# Altium project UI.PrjPcb
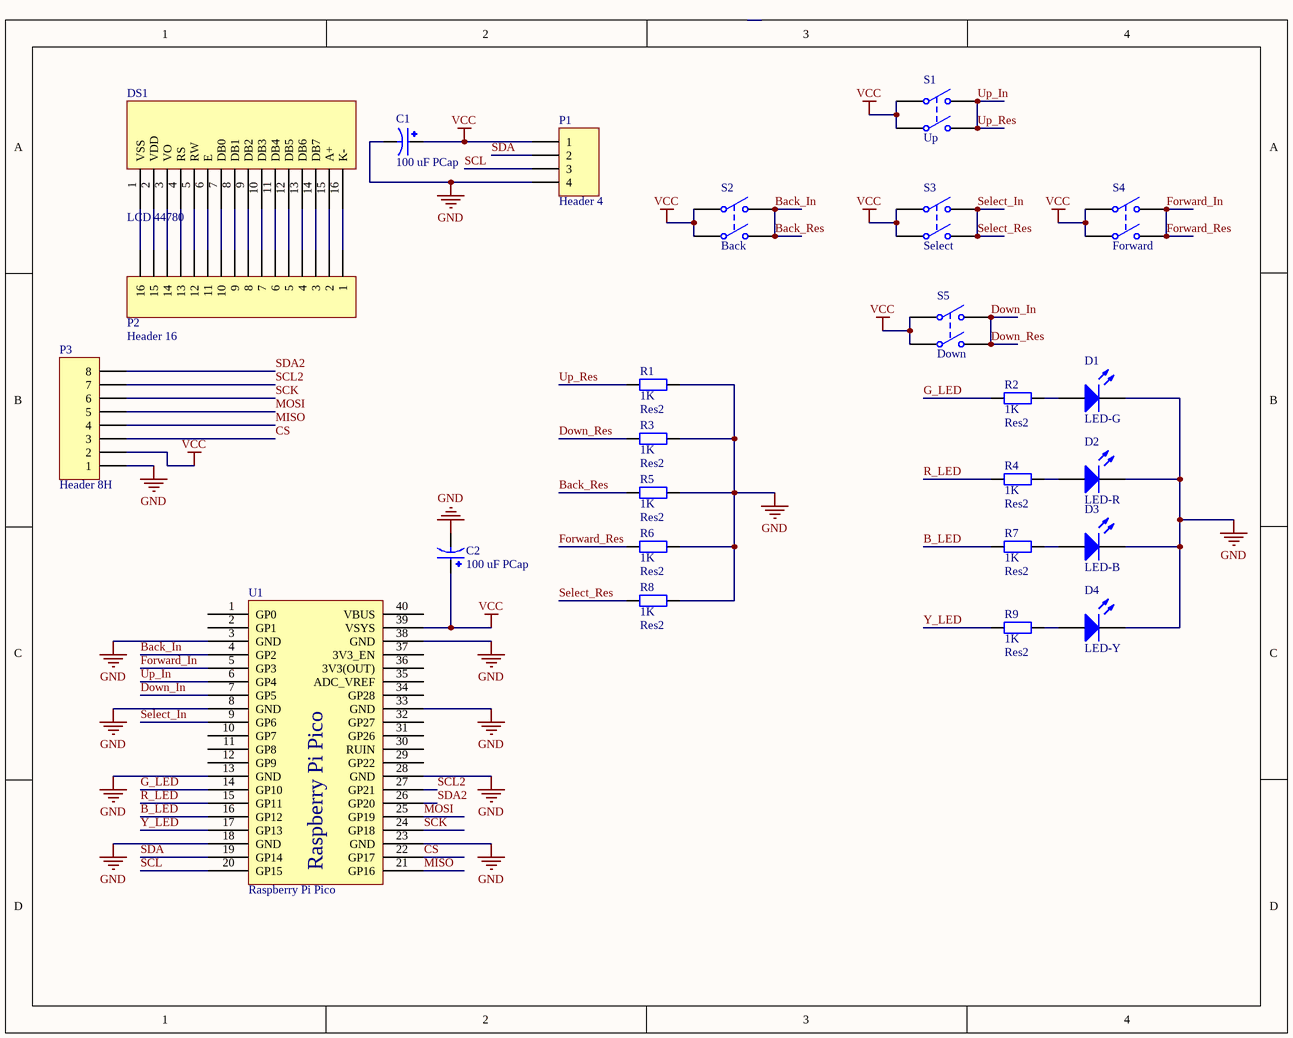
[diagram p0: UI Schematic.SchDoc]
1 sheet, 25 parts. Net scope: global (net labels, ports and power ports of the same name join across sheets).
Board file: UI PCB.PcbDoc

## Sheet UI Schematic.SchDoc
size A; SheetNumber: 1; SheetTotal: 5; SPICEModelCacheYSEURQHB: <root> / <DocumentId>YSEURQHB</DocumentId> / <CacheFrame Number="0"> / <Model Name="led1" Kind="MDL"> / <Text>*Typ RED GaAs LED: Vf=1.7V Vr=4V If=40mA trr=3uS / *LED Pinout: 1=A, 2=K / .MODEL LED1 D (IS=93.2P RS=42M N=3.73 BV=4 IBV=10U / + CJO=2.97P VJ=.75 M=.333 TT=4.32U)</Text> / </Model> / </CacheFrame> / </root>

### Parts
C1  100 uF PCap  [100uF PCap]
C2  100 uF PCap  [100uF PCap]
D1  LED-G  [LED-1]
D2  LED-R  [LED-1]
D3  LED-B  [LED-1]
D4  LED-Y  [LED-1]
DS1  LCD 44780  [OLED 16x2]
P1  Header 4  [HDR1X4]
P2  Header 16  [HDR1X16]
P3  Header 8H  [HDR1X8H]
R1  Res2  value 1K  [AXIAL-0.4]
R2  Res2  value 1K  [AXIAL-0.4]
R3  Res2  value 1K  [AXIAL-0.4]
R4  Res2  value 1K  [AXIAL-0.4]
R5  Res2  value 1K  [AXIAL-0.4]
R6  Res2  value 1K  [AXIAL-0.4]
R7  Res2  value 1K  [AXIAL-0.4]
R8  Res2  value 1K  [AXIAL-0.4]
R9  Res2  value 1K  [AXIAL-0.4]
S1  Up  [DPST-4]
S2  Back  [DPST-4]
S3  Select  [DPST-4]
S4  Forward  [DPST-4]
S5  Down  [DPST-4]
U1  Raspberry Pi Pico  [Raspberry Pi Pico]

### Nets
GND: C1.N C2.N D1.2(K) D2.2(K) D3.2(K) D4.2(K) P1.4 P3.1 R1.2 R3.2 R5.2 R6.2 R8.2 U1.3(GND) U1.8(GND) U1.13(GND) U1.18(GND) U1.23(GND) U1.28(GND) U1.33(GND) U1.38(GND)
VCC: C1.P C2.P P1.1 P3.2 S1.1(COMMON1) S1.3(COMMON2) S2.1(COMMON1) S2.3(COMMON2) S3.1(COMMON1) S3.3(COMMON2) S4.1(COMMON1) S4.3(COMMON2) S5.1(COMMON1) S5.3(COMMON2) U1.39(VSYS)
B_LED: R7.1 U1.16(GP12)
Back_In: R5.1 S2.2(NO1) S2.4(NO2) U1.4(GP2)  [also labelled Back_Res]
CS: P3.3 U1.22(GP17)
Down_In: R3.1 S5.2(NO1) S5.4(NO2) U1.7(GP5)  [also labelled Down_Res]
Forward_In: R6.1 S4.2(NO1) S4.4(NO2) U1.5(GP3)  [also labelled Forward_Res]
G_LED: R2.1 U1.14(GP10)
MISO: P3.4 U1.21(GP16)
MOSI: P3.5 U1.25(GP19)
R_LED: R4.1 U1.15(GP11)
SCK: P3.6 U1.24(GP18)
SCL: P1.3 U1.20(GP15)
SCL2: P3.7 U1.27(GP21)
SDA: P1.2 U1.19(GP14)
SDA2: P3.8 U1.26(GP20)
Select_In: R8.1 S3.2(NO1) S3.4(NO2) U1.9(GP6)  [also labelled Select_Res]
Up_In: R1.1 S1.2(NO1) S1.4(NO2) U1.6(GP4)  [also labelled Up_Res]
Y_LED: R9.1 U1.17(GP13)
NetD1_1: D1.1(A) R2.2
NetD2_1: D2.1(A) R4.2
NetD3_1: D3.1(A) R7.2
NetD4_1: D4.1(A) R9.2
NetDS1_1: DS1.1(VSS) P2.16
NetDS1_2: DS1.2(VDD) P2.15
NetDS1_3: DS1.3(VO) P2.14
NetDS1_4: DS1.4(RS) P2.13
NetDS1_5: DS1.5(RW) P2.12
NetDS1_6: DS1.6(E) P2.11
NetDS1_7: DS1.7(DB0) P2.10
NetDS1_8: DS1.8(DB1) P2.9
NetDS1_9: DS1.9(DB2) P2.8
NetDS1_10: DS1.10(DB3) P2.7
NetDS1_11: DS1.11(DB4) P2.6
NetDS1_12: DS1.12(DB5) P2.5
NetDS1_13: DS1.13(DB6) P2.4
NetDS1_14: DS1.14(DB7) P2.3
NetDS1_15: DS1.15(A+) P2.2
NetDS1_16: DS1.16(K-) P2.1

Not connected (* = marked no-connect by the designer): U1 1(GP0) 2(GP1) 10(GP7) 11(GP8) 12(GP9) 29(GP22) 30(RUIN) 31(GP26) 32(GP27) 34(GP28) 35(ADC_VREF) 36(3V3(OUT)) 37(3V3_EN) 40(VBUS)

### Library data of the parts
C1 C2 = 100 uF PCap: Capacitor; Aluminum Electrolytic; Radial Al Electrolytic Cap; 100uF 63V; MF: Panasonic Electronic; MP: EEU-FC1J101; Package: RADIAL-2 Panasonic; Price: None; Check_prices: https://www.snapeda.com/parts/EEU-FC1J101/Panasonic%20Electronic%20Components/view-part/494707/?ref=eda; Value: *; SnapEDA_Link: https://www.snapeda.com/parts/EEU-FC1J101/Panasonic%20Electronic%20Components/view-part/494707/?ref=snap; Availability: In Stock
D1-D4 = LED1: Typical RED GaAs LED; Published: 8-Jun-2000; LatestRevisionDate: 08-Jul-2005; LatestRevisionNote: Mech Layer 1 removed.; PackageReference: LED-1; Publisher: Altium Limited; PackageDescription: LED; 2 Leads
P1 = Header 4: Header, 4-Pin; LatestRevisionDate: 17-Jul-2002; LatestRevisionNote: Re-released for DXP Platform.; Publisher: Altium Limited
P2 = Header 16: Header, 16-Pin; LatestRevisionDate: 17-Jul-2002; LatestRevisionNote: Re-released for DXP Platform.; Publisher: Altium Limited
P3 = Header 8H: Header, 8-Pin, Right Angle; LatestRevisionDate: 17-Jul-2002; LatestRevisionNote: Re-released for DXP Platform.; Publisher: Altium Limited
R1-R9 = Res2: Resistor; Published: 8-Jun-2000; LatestRevisionDate: 17-Jul-2002; LatestRevisionNote: Re-released for DXP Platform.; PackageReference: AXIAL-0.4; Publisher: Altium Limited; PackageDescription: Axial Device, Thru-Hole; 2 Leads; 0.4 in Pin Spacing
S1-S5 = SW-DPST: Double-Pole, Single-Throw Switch; Published: 24-Mar-1999; LatestRevisionDate: 17-Jul-2002; LatestRevisionNote: Re-released for DXP Platform.; PackageReference: DPST-4; Publisher: Altium Limited; PackageDescription: Switch; 4 Leads